# Altium schematic sheet Current Sense.SchDoc
size B
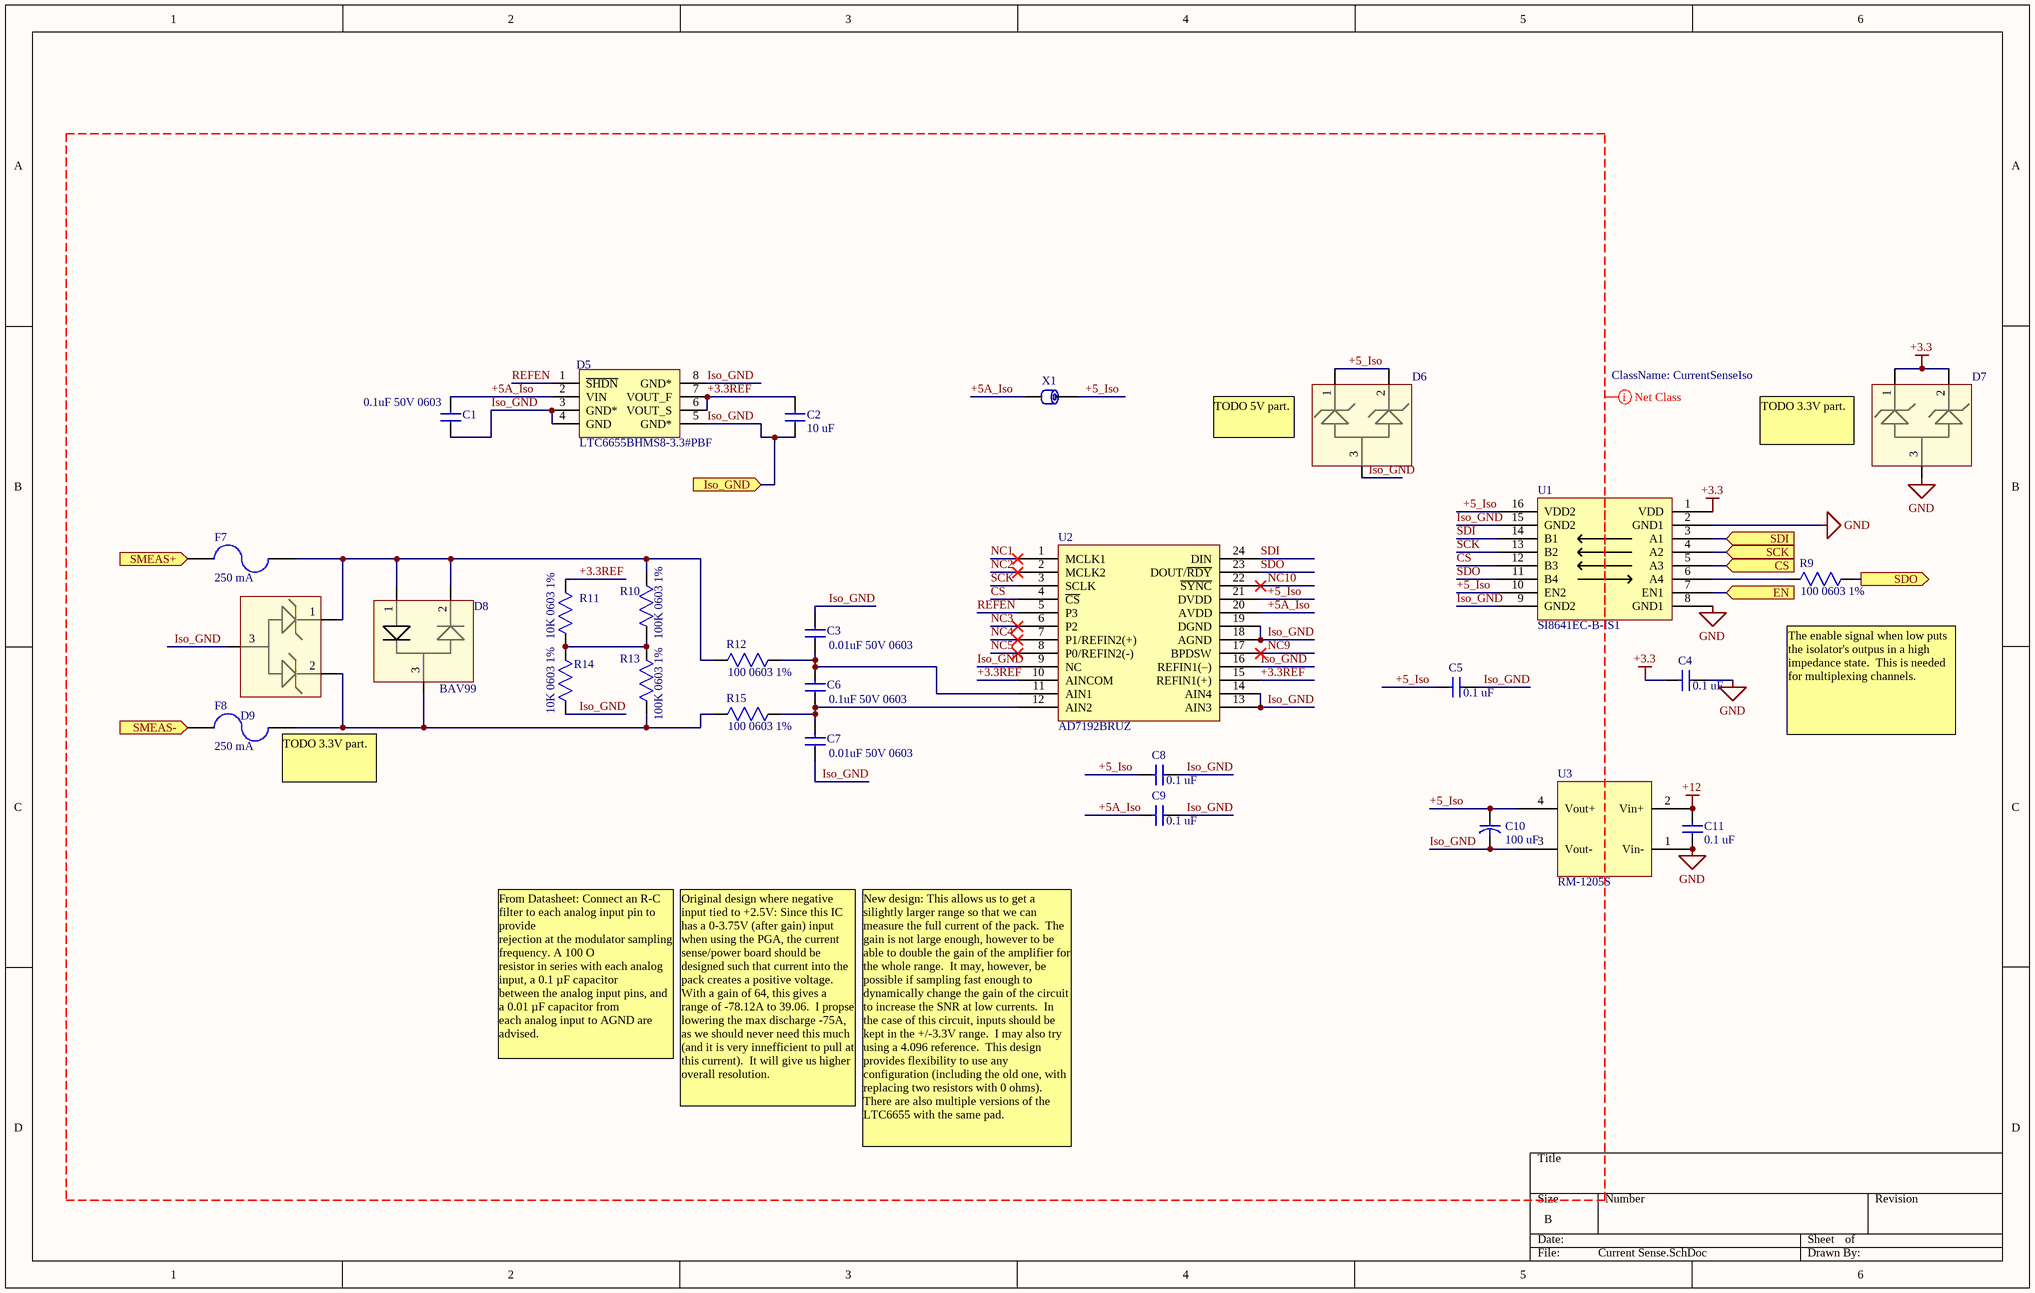
[diagram p0: Current Sense.SchDoc]

## Parts
C1  value 0.1uF 50V 0603  [0603_cap]  (hidden comment: CAP 0603)
C2  value 10 uF  [0805_Capacitor]  (hidden comment: CAP 10 uF)
C3  value 0.01uF 50V 0603  [0603_cap]  (hidden comment: CAP 0603)
C4  value 0.1 uF  [0603_cap]  (hidden comment: CAP 0603)
C5  value 0.1 uF  [0603_cap]  (hidden comment: CAP 0603)
C6  value 0.1uF 50V 0603  [0603_cap]  (hidden comment: CAP 0603)
C7  value 0.01uF 50V 0603  [0603_cap]  (hidden comment: CAP 0603)
C8  value 0.1 uF  [0603_cap]  (hidden comment: CAP 0603)
C9  value 0.1 uF  [0603_cap]  (hidden comment: CAP 0603)
C10  value 100 uF  [EEE-FP1V101AP]  (hidden comment: EEE-FP1V101AP)
C11  value 0.1 uF  [0603_cap]  (hidden comment: CAP 0603)
D5  Manufacturer PN: LTC6655BHMS8-3.3#PBF  [TSOP65P490X110-8N]  (hidden comment: D_LTC6655BHMS8-3.3#PBF)
D6  MMBZ6V8AL,215  [SOT-23]  (value not drawn)
D7  MMBZ6V8AL,215  [SOT-23]  (value not drawn)
D8  BAV99  [SOT-23]
D9  MMBZ6V8AL,215  [SOT-23]  (value not drawn)
F7  250 mA  [1206_RESISTOR]
F8  250 mA  [1206_RESISTOR]
R9  value 100 0603 1%  [0603_res]  (hidden comment: RES 0603)
R10  value 100K 0603 1%  [0603_res]  (hidden comment: RES 0603)
R11  value 10K 0603 1%  [0603_res]  (hidden comment: RES 0603)
R12  value 100 0603 1%  [0603_res]  (hidden comment: RES 0603)
R13  value 100K 0603 1%  [0603_res]  (hidden comment: RES 0603)
R14  value 10K 0603 1%  [0603_res]  (hidden comment: RES 0603)
R15  value 100 0603 1%  [0603_res]  (hidden comment: RES 0603)
U1  Manufacturer PN: SI8641EC-B-IS1  [SOIC16_SI8641]  (hidden comment: U_SI6841EC-B)
U2  Manufacturer PN: AD7192BRUZ  [TSOP65P640X120-24N]  (hidden comment: U_AD7192)
U3  Manufacturer PN: RM-1205S  [SIP4]  (hidden comment: U_RM-1205S)
X1  Ferrite Bead  [0603_res]  (value not drawn)

## Ports
CS, EN, Iso_GND, SCK, SDI, SDO, SMEAS+, SMEAS-

## Nets
+3.3: C4.2 D7.1 D7.2 U1.1(VDD)
+12: C11.1 U3.2(Vin+)
GND: C4.1 C11.2 D7.3 U1.2(GND1) U1.8(GND1) U3.1(Vin-)
+3.3REF: C2.1 D5.6(VOUT_S) D5.7(VOUT_F) R11.2 U2.10(AINCOM) U2.15(REFIN1(+))
+5_Iso: C5.2 C8.2 C10.1 D6.1 D6.2 U1.10(EN2) U1.16(VDD2) U2.21(DVDD) U3.4(Vout+) X1.2
+5A_Iso: C1.1 C9.2 D5.2(VIN) U2.20(AVDD) X1.1
CS: U1.5(A3) ; port CS
CS: U1.12(B3) U2.4(~{CS})  [a separate net that carries the same name]
EN: U1.7(EN1) ; port EN
Iso_GND: C1.2 C2.2 C3.1 C5.1 C7.2 C8.1 C9.1 C10.2 D5.3(GND*) D5.4(GND) D5.5(GND*) D5.8(GND*) D6.3 D9.3 R14.1 U1.9(GND2) U1.15(GND2) U2.9(NC) U2.13(AIN3) U2.14(AIN4) U2.16(REFIN1(–)) U2.18(AGND) U2.19(DGND) U3.3(Vout-) ; port Iso_GND
NC1: U2.1(MCLK1)
NC2: U2.2(MCLK2)
NC3: U2.6(P2)
NC4: U2.7(P1/REFIN2(+))
NC5: U2.8(P0/REFIN2(-))
NC9: U2.17(BPDSW)
NC10: U2.22(~{SYNC})
REFEN: D5.1(~{SHDN}) U2.5(P3)
SCK: U1.4(A2) ; port SCK
SCK: U1.13(B2) U2.3(SCLK)  [a separate net that carries the same name]
SDI: U1.3(A1) ; port SDI
SDI: U1.14(B1) U2.24(DIN)  [a separate net that carries the same name]
SDO: U1.11(B4) U2.23(DOUT/~{RDY})
SDO: R9.1 ; port SDO  [a separate net that carries the same name]
SMEAS+: F7.1 ; port SMEAS+
SMEAS-: F8.1 ; port SMEAS-
NetC3_2: C3.2 C6.1 R12.1 U2.11(AIN1)
NetC6_2: C6.2 C7.1 R15.1 U2.12(AIN2)
NetD8_1: D8.1 D8.2 D9.1 F7.2 R10.2 R12.2
NetD8_3: D8.3 D9.2 F8.2 R13.1 R15.2
NetR9_2: R9.2 U1.6(A4)
NetR10_1: R10.1 R11.1 R13.2 R14.2

## Layout directives
net class CurrentSenseIso: +3.3REF, +5_Iso, +5A_Iso, CS, Iso_GND, NC1, NC2, NC3, NC4, NC5, NC9, NC10, REFEN, SCK, SDI, SDO

## Notes on the sheet
- (near D6) TODO 5V part.
- (near D7) TODO 3.3V part.
- (near F8) TODO 3.3V part.
- (near R9) The enable signal when low puts the isolator's outpus in a high impedance state.  This is needed for multiplexing channels.
- From Datasheet: Connect an R-C filter to each analog input pin to provide
  rejection at the modulator sampling frequency. A 100 O
  resistor in series with each analog input, a 0.1 µF capacitor
  between the analog input pins, and a 0.01 µF capacitor from
  each analog input to AGND are advised.
- Original design where negative input tied to +2.5V: Since this IC has a 0-3.75V (after gain) input when using the PGA, the current sense/power board should be designed such that current into the pack creates a positive voltage.  With a gain of 64, this gives a range of -78.12A to 39.06.  I propse lowering the max discharge -75A, as we should never need this much (and it is very innefficient to pull at this current).  It will give us higher overall resolution.
- New design: This allows us to get a silightly larger range so that we can measure the full current of the pack.  The gain is not large enough, however to be able to double the gain of the amplifier for the whole range.  It may, however, be possible if sampling fast enough to dynamically change the gain of the circuit to increase the SNR at low currents.  In the case of this circuit, inputs should be kept in the +/-3.3V range.  I may also try using a 4.096 reference.  This design provides flexibility to use any configuration (including the old one, with replacing two resistors with 0 ohms).  There are also multiple versions of the LTC6655 with the same pad.

## Library data of the parts
C1 C3-C9 C11 = C_0603: CAP CERM 0603; Known Distributors: Digikey; Package: 0603
C2 = C_0805_10uF: CAP CERM 10 uF; SVP Creator: Matt Rogge; Package: 0805; Known Distributors: Digikey; ComponentLink1Description: Datasheet; ComponentLink1URL: SVN Datasheet URL
C10 = C_POLY_100uF_35V: CAP ALUM 100UF 35V 20% SMD; Manufacturer: Panasonic; SVP Creator: Jonathan Nutzmann; ESR: 80mOhms; Package: Radial, Can - SMD; Known Distributors: Digikey; Manufacturer PN: EEE-FP1V101AP; ComponentLink1Description: Datasheet; ComponentLink1URL: http://search.digikey.com/scripts/DkSearch/dksus.dll?Detail&name=PCE4442CT-ND; Price: 1.03; Tolerance: 20%
D5 = D_LTC6655BHMS8-3.3#PBF: IC VREF SERIES PREC 3.3V 8-MSOP; Manufacturer: Linear Technology; SVP Creator: Jonathan Nutzmann; Known Distributors: Digi-Key; ComponentLink1Description: Datasheet
D6 D7 D9 = D_MMBZ6V8AL,215: DIODE ESD PROT DBL 4.5V SOT23; Manufacturer: NXP; SVP Creator: Jonathan Nutzmann; Package: SOT-23; Manufacturer PN: MMBZ6V8AL,215; ComponentLink1Description: Datasheet; ComponentLink1URL: SVN Datasheet URL; Price: .45
D8 = D_BAV99: DIODE ULTRAFAST HI COND SOT-23; Manufacturer: Fairchild; SVP Creator: Jonathan Nutzmann; Package: SOT-23; Manufacturer PN: BAV99
F7 F8 = F_250mA_1206: FUSE 250 mA 1206; SVN Creator: Jonathan Nutzmann; SVN Reviewer 2: *; Package: 1206
R9-R15 = R_0603: Known Distributors: Digikey; Package: 0603
U1 = U_SI6841EC-B: IC ISOLATOR 4CH 3.75V 16-SOIC; Manufacturer: Silicon Labs
U2 = U_AD7192: IC ADC 24BIT 2CH W/PGA 24-TSSOP; Manufacturer: Analog Devices
U3 = U_RM-1205S: CONV DC/DC 0.25W SGL 5V OUT SIP4; Manufacturer: Recom Power Inc
X1 = X_FERRITE_0805: FERRITE CHIP BEAD 600 OHM SMD; Manufacturer: TDK Corp; Manufacturer PN: MPZ2012S601A; SVP Creator: Brett Paulsen; Current Rating: 2A; Package: 0805; Known Distributors: Digikey